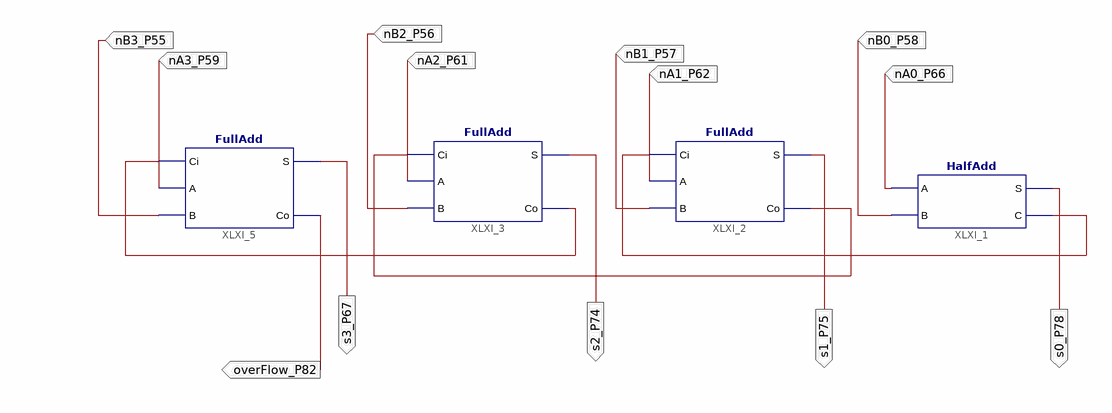
[diagram p0: schematic sheet 1]
// Xilinx ISE schematic Add.sch (spartan6) as structural Verilog: 4 symbols, 13 ports
module Add (
  input  nA0_P66,
  input  nB0_P58,
  input  nA1_P62,
  input  nA3_P59,
  input  nA2_P61,
  input  nB1_P57,
  input  nB2_P56,
  input  nB3_P55,
  output overFlow_P82,
  output s0_P78,
  output s1_P75,
  output s3_P67,
  output s2_P74
);

  wire XLXN_3, XLXN_9, XLXN_11;

  HalfAdd XLXI_1 (.A(nA0_P66), .B(nB0_P58), .S(s0_P78), .C(XLXN_3));
  FullAdd XLXI_2 (.Ci(XLXN_3), .A(nA1_P62), .B(nB1_P57), .S(s1_P75), .Co(XLXN_9));
  FullAdd XLXI_3 (.Ci(XLXN_9), .A(nA2_P61), .B(nB2_P56), .S(s2_P74), .Co(XLXN_11));
  FullAdd XLXI_5 (.Ci(XLXN_11), .A(nA3_P59), .B(nB3_P55), .S(s3_P67), .Co(overFlow_P82));
endmodule
